# Altium project BaseBoard.PrjPcb
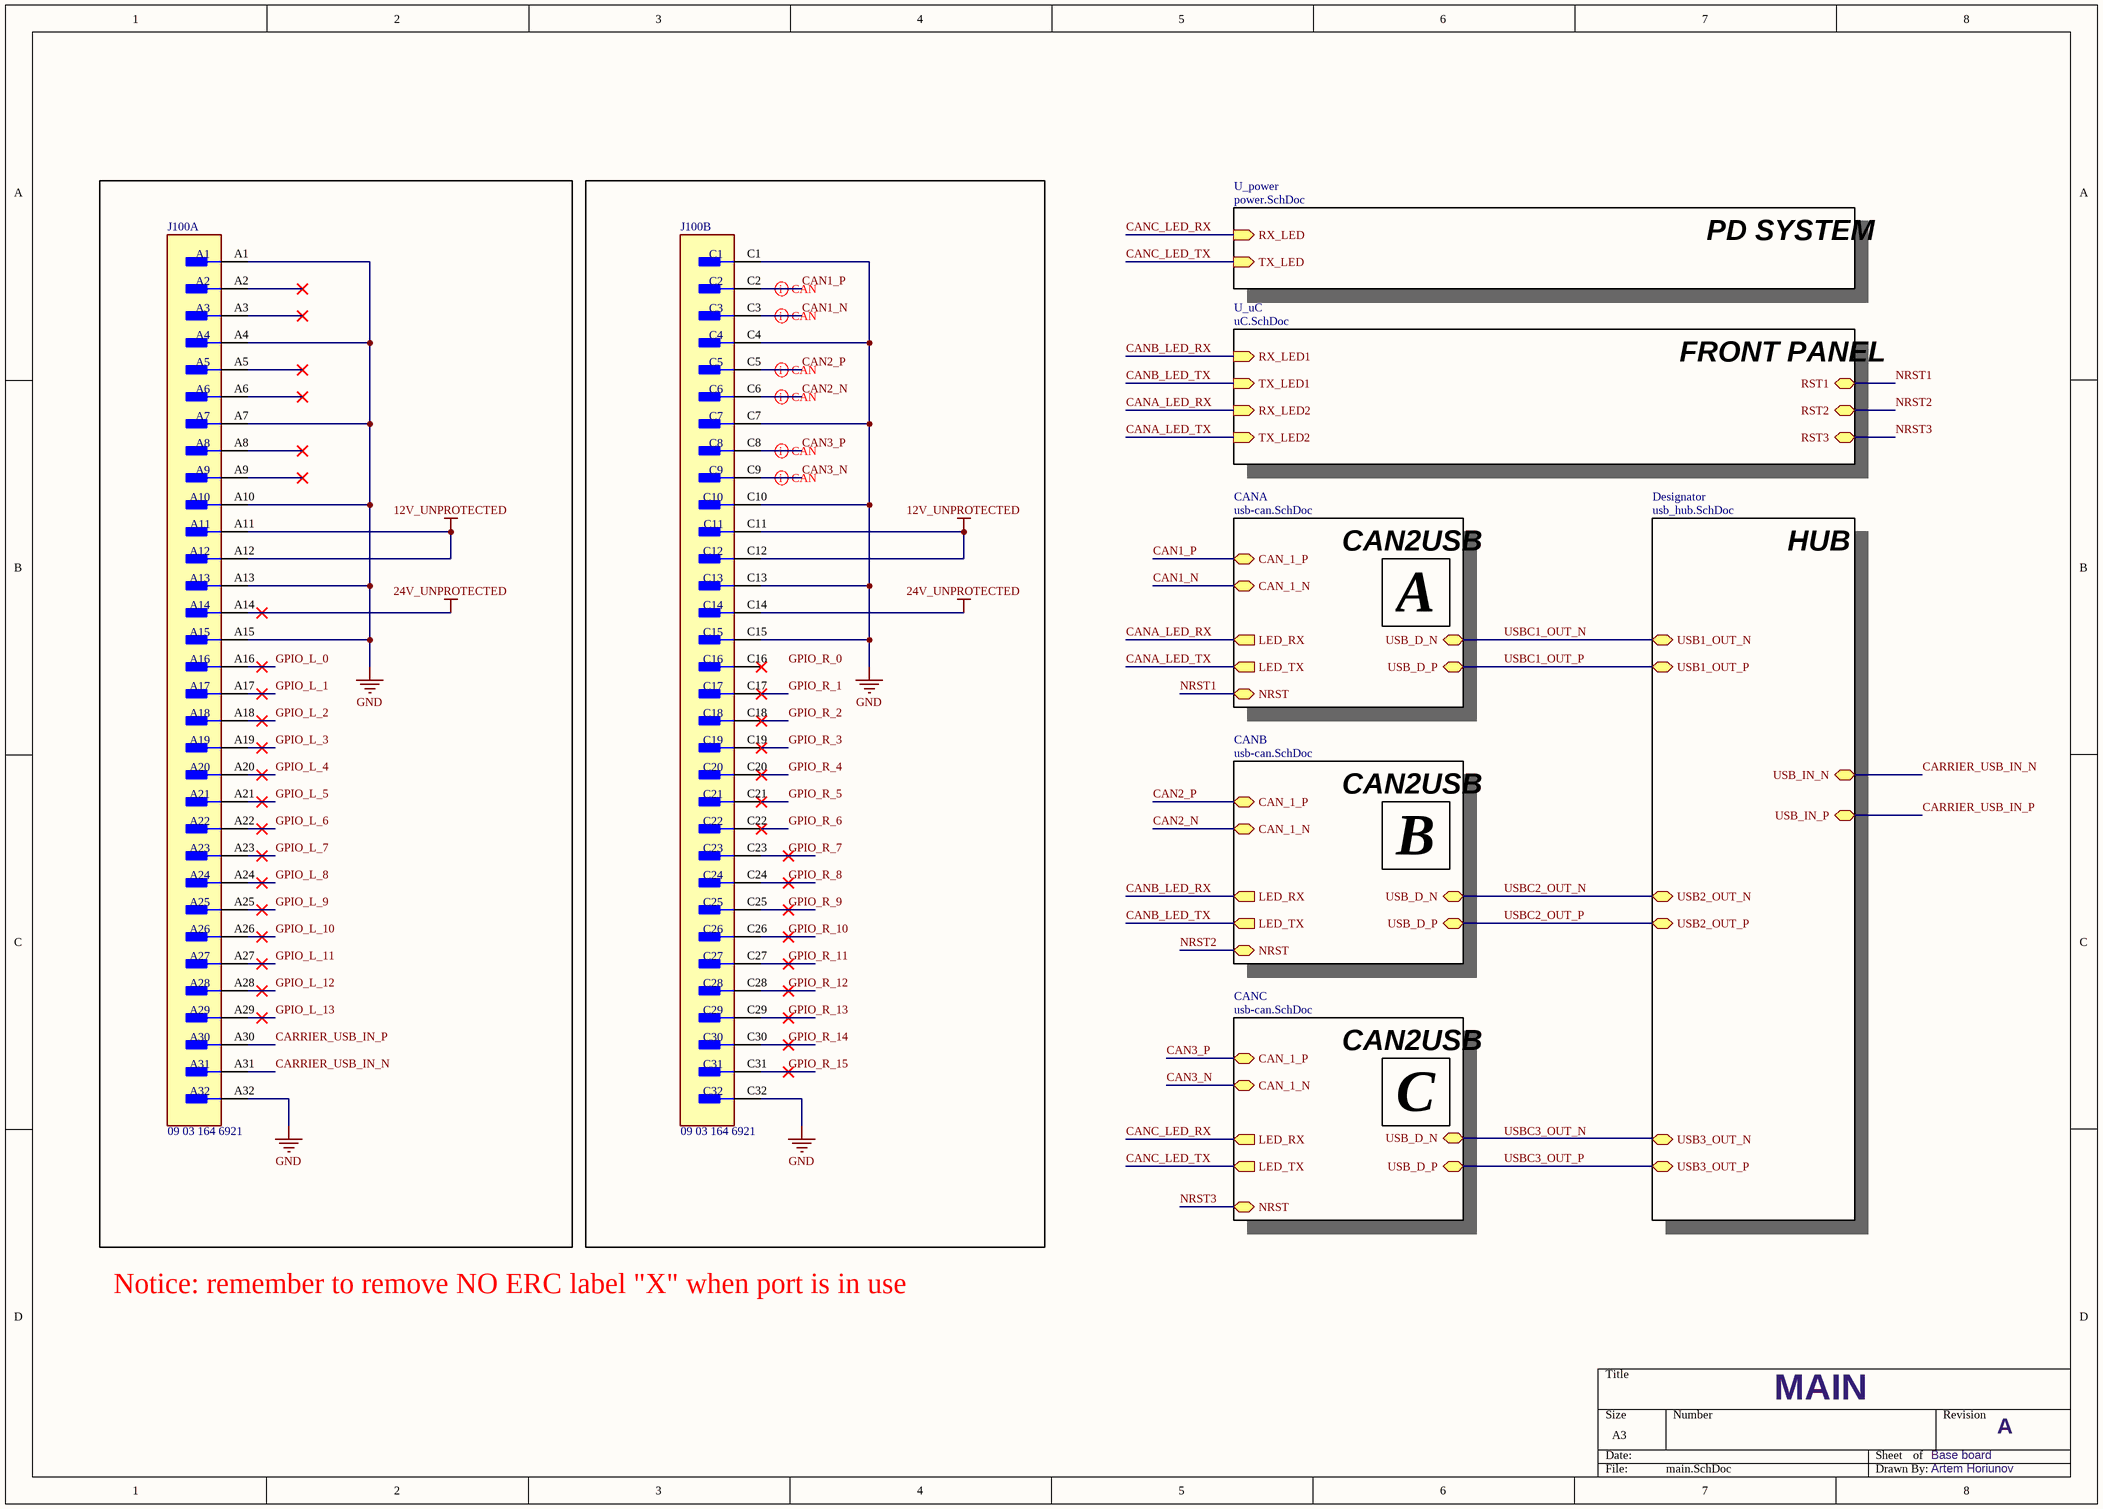
[diagram p0: main.SchDoc]
5 sheets, 186 parts. Net scope: hierarchical (ports join the sheet entries above them; power ports are global).
Board file: BaseBoard.PcbDoc
Sheets:
  main.SchDoc
    U_power = power.SchDoc
    U_uC = uC.SchDoc
    CANA = usb-can.SchDoc
    CANB = usb-can.SchDoc
    CANC = usb-can.SchDoc
    Designator = usb_hub.SchDoc

## Sheet main.SchDoc
size A3; SheetNumber: 1; SheetTotal: 5

### Parts
J100  09 03 164 6921  [FP-09_03_164_6921-MFG]  (parts A,B of 2)

### Sub-sheets
CANA = usb-can.SchDoc: CAN_1_P (bidir), CAN_1_N (bidir), LED_RX (out), LED_TX (out), USB_D_N (bidir), USB_D_P (bidir), NRST (bidir)
CANB = usb-can.SchDoc: CAN_1_P (bidir), CAN_1_N (bidir), LED_RX (out), LED_TX (out), USB_D_N (bidir), USB_D_P (bidir), NRST (bidir)
CANC = usb-can.SchDoc: CAN_1_N (bidir), CAN_1_P (bidir), LED_RX (out), LED_TX (out), USB_D_N (bidir), USB_D_P (bidir), NRST (bidir)
Designator = usb_hub.SchDoc: USB3_OUT_N (bidir), USB3_OUT_P (bidir), USB2_OUT_N (bidir), USB2_OUT_P (bidir), USB1_OUT_N (bidir), USB1_OUT_P (bidir), USB_IN_N (bidir), USB_IN_P (bidir)
U_power = power.SchDoc: RX_LED (in), TX_LED (in)
U_uC = uC.SchDoc: RX_LED1 (in), TX_LED1 (in), RX_LED2 (in), TX_LED2 (in), RST1 (bidir), RST2 (bidir), RST3 (bidir)

### Nets
12V_UNPROTECTED: J100.A11 J100.A12 J100.C11 J100.C12
24V_UNPROTECTED: J100.A14 J100.C14
GND: J100.A1 J100.A4 J100.A7 J100.A10 J100.A13 J100.A15 J100.A32 J100.C1 J100.C4 J100.C7 J100.C10 J100.C13 J100.C15 J100.C32
CAN1_N: J100.C3 ; sheet CANA/CAN_1_N
CAN1_P: J100.C2 ; sheet CANA/CAN_1_P
CAN2_N: J100.C6 ; sheet CANB/CAN_1_N
CAN2_P: J100.C5 ; sheet CANB/CAN_1_P
CAN3_N: J100.C9 ; sheet CANC/CAN_1_N
CAN3_P: J100.C8 ; sheet CANC/CAN_1_P
CANA_LED_RX: sheet U_uC/RX_LED2, sheet CANA/LED_RX
CANA_LED_TX: sheet U_uC/TX_LED2, sheet CANA/LED_TX
CANB_LED_RX: sheet U_uC/RX_LED1, sheet CANB/LED_RX
CANB_LED_TX: sheet U_uC/TX_LED1, sheet CANB/LED_TX
CANC_LED_RX: sheet U_power/RX_LED, sheet CANC/LED_RX
CANC_LED_TX: sheet U_power/TX_LED, sheet CANC/LED_TX
CARRIER_USB_IN_N: J100.A31 ; sheet Designator/USB_IN_N
CARRIER_USB_IN_P: J100.A30 ; sheet Designator/USB_IN_P
GPIO_L_0: J100.A16
GPIO_L_1: J100.A17
GPIO_L_2: J100.A18
GPIO_L_3: J100.A19
GPIO_L_4: J100.A20
GPIO_L_5: J100.A21
GPIO_L_6: J100.A22
GPIO_L_7: J100.A23
GPIO_L_8: J100.A24
GPIO_L_9: J100.A25
GPIO_L_10: J100.A26
GPIO_L_11: J100.A27
GPIO_L_12: J100.A28
GPIO_L_13: J100.A29
GPIO_R_1: J100.C17
GPIO_R_2: J100.C18
GPIO_R_3: J100.C19
GPIO_R_4: J100.C20
GPIO_R_5: J100.C21
GPIO_R_6: J100.C22
GPIO_R_7: J100.C23
GPIO_R_8: J100.C24
GPIO_R_9: J100.C25
GPIO_R_10: J100.C26
GPIO_R_11: J100.C27
GPIO_R_12: J100.C28
GPIO_R_13: J100.C29
GPIO_R_14: J100.C30
GPIO_R_15: J100.C31
NRST1: sheet U_uC/RST1, sheet CANA/NRST  [project net NRST]
NRST2: sheet U_uC/RST2, sheet CANB/NRST  [project net NRST]
NRST3: sheet U_uC/RST3, sheet CANC/NRST  [project net NRST]
U3_OUT_N: sheet CANC/USB_D_N, sheet Designator/USB3_OUT_N
USBC1_OUT_N: sheet CANA/USB_D_N, sheet Designator/USB1_OUT_N  [project net U1_OUT_N]
USBC1_OUT_P: sheet CANA/USB_D_P, sheet Designator/USB1_OUT_P  [project net U1_OUT_P]
USBC2_OUT_N: sheet CANB/USB_D_N, sheet Designator/USB2_OUT_N  [project net U2_OUT_N]
USBC2_OUT_P: sheet CANB/USB_D_P, sheet Designator/USB2_OUT_P  [project net U2_OUT_P]
USBC3_OUT_P: sheet CANC/USB_D_P, sheet Designator/USB3_OUT_P  [project net U3_OUT_P]

Not connected (* = marked no-connect by the designer): J100 A2* A3* A5* A6* A8* A9* C16*

### Layout directives
differential pair; differential pair class CAN: CAN1_N, CAN1_P, CAN2_N, CAN2_P, CAN3_N, CAN3_P

### Notes on the sheet
- PD SYSTEM
- FRONT PANEL
- CAN2USB
- HUB
- A
- B
- C
- Notice: remember to remove NO ERC label "X" when port is in use
- MAIN
- Base board
- Artem Horiunov
- Labels drawn without touching a wire or pin: GPIO_R_0, USBC3_OUT_N

### Library data of the parts
J100 = CMP-33111-000001-1: CONN DIN HDR 96POS PCB RA; Manufacturer: Harting; Pitch: 2.54mm; Number Of Contacts: 64; Current Rating: 2A; Conn Orientation: Right Angle; Conn Gender: Male; Device Class L1: Connectors; Package: 0; Number Of Rows: 2; ComponentLink2URL: https://b2b.harting.com/files/download/PRD/PDF_DS/09031200203_100580339DRW000B.pdf; Height: 11mm; Temperature Range Low: -55°C; Digikey Description: CONN DIN HDR 96POS PCB RA; Mouser Description: Conn DIN 41612 M 64 POS 2.54mm Solder RA Thru-Hole Box; Footprint Url: https://b2b.harting.com/files/download/PRD/PDF_TS/0903164X921_100072506DRW176A.pdf; Lead Free: Yes; RoHS: TRUE; Device Class L2: Backplane Connectors; Category: Conn; Manufacturer Part Number: 09 03 164 6921; Temperature Range High: +125°C; Temperature: -55°C to +125°C; ComponentLink2Description: Datasheet; Octopart: https://octopart.com/09031646921-harting+elektronik-42933; Device Class L3: unset; Automotive: No; Contact Material: Gold,Nickel

## Sheet power.SchDoc
size A3; SheetNumber: 3; SheetTotal: 5
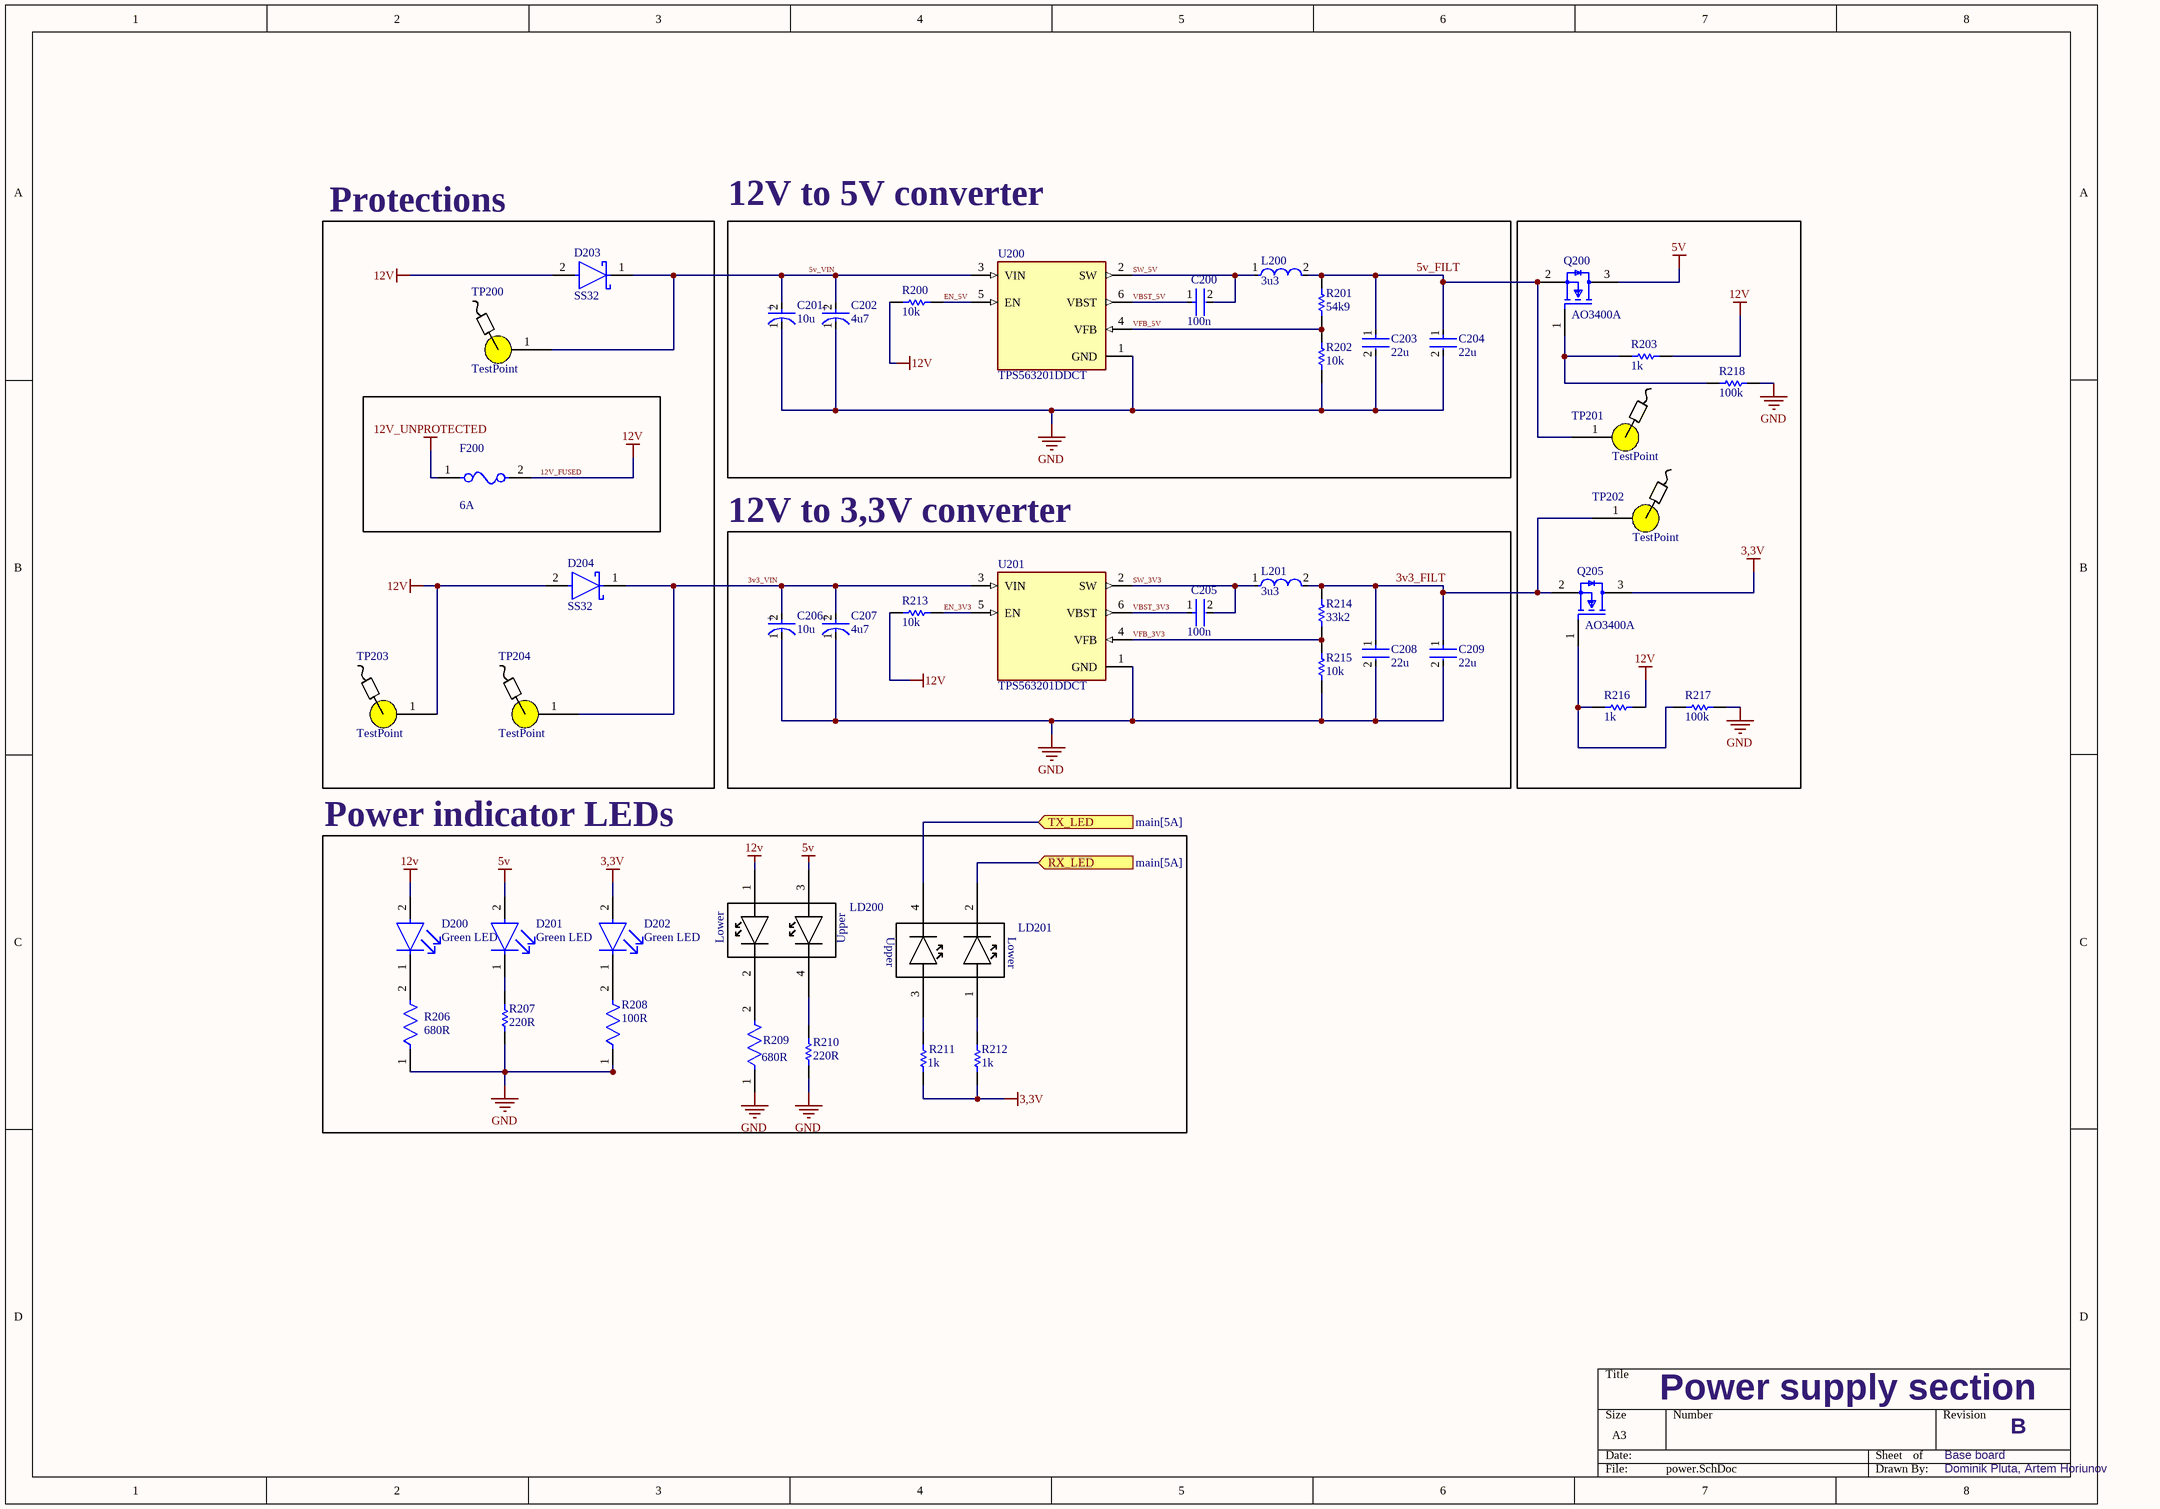
[diagram p1: power.SchDoc]

### Parts
C200  100n  [FP-C0603C-CF-MFG]
C201  10u  [FP-POSCAP-B2-MFG]
C202  4u7  [FP-POSCAP-B2-MFG]
C203  22u  [FP-C3216-085-0_2-MFG]
C204  22u  [FP-C3216-085-0_2-MFG]
C205  100n  [FP-C0603C-CF-MFG]
C206  10u  [FP-POSCAP-B2-MFG]
C207  4u7  [FP-POSCAP-B2-MFG]
C208  22u  [FP-C3216-085-0_2-MFG]
C209  22u  [FP-C3216-085-0_2-MFG]
D200  Green LED  [FP-HSME-C191-MFG]
D201  Green LED  [FP-HSME-C191-MFG]
D202  Green LED  [FP-HSME-C191-MFG]
D203  SS32  [FP-403AG-MFG]
D204  SS32  [FP-403AG-MFG]
F200  6A  [FP-0466-MFG]
L200  3u3  [FP-SRP4020TA-MFG]
L201  3u3  [FP-SRP4020TA-MFG]
LD200  (no value)  [LED_HOLDER]
LD201  (no value)  [LED_HOLDER]
Q200  AO3400A  [FP-SOT23-MFG]
Q205  AO3400A  [FP-SOT23-MFG]
R200  10k  [RESC0603(1608)_N]
R201  54k9  [RESC0603(1608)_N]
R202  10k  [RESC0603(1608)_N]
R203  1k  [RESC0603(1608)_N]
R206  680R  [FP-CRCW0603-e3-MFG]
R207  220R  [RESC1608X55X25ML10T15]
R208  100R  [FP-RC0603-0_55-MFG]
R209  680R  [FP-CRCW0603-e3-MFG]
R210  220R  [RESC1608X55X25ML10T15]
R211  1k  [RESC0603(1608)_N]
R212  1k  [RESC0603(1608)_N]
R213  10k  [RESC0603(1608)_N]
R214  33k2  [RESC0603(1608)_N]
R215  10k  [RESC0603(1608)_N]
R216  1k  [RESC0603(1608)_N]
R217  100k  [RESC0603(1608)_N]
R218  100k  [RESC0603(1608)_N]
TP200  TestPoint  [TestPoint]
TP201  TestPoint  [TestPoint]
TP202  TestPoint  [TestPoint]
TP203  TestPoint  [TestPoint]
TP204  TestPoint  [TestPoint]
U200  TPS563201DDCT  [SOT95P280X110-6N]
U201  TPS563201DDCT  [SOT95P280X110-6N]

### Blocks framed on the sheet
Protections: D203 D204 F200 TP200 TP203 TP204
12V to 5V converter: C200-C204 L200 R200-R202 U200
12V to 3,3V converter: C205-C209 L201 R213-R215 U201
Power indicator LEDs: D200-D202 LD200 LD201 R206-R212

### Ports
RX_LED (in, see main[5A]), TX_LED (in, see main[5A])

### Nets
3,3V: D202.2(A) Q205.3(D) R211.1 R212.1
5v: D201.2(A) LD200.3 Q200.3(D)
12V_FUSED: D200.2(A) D203.2(A) D204.2(A) F200.2 LD200.1 R200.2 R203.1 R213.2 R216.1 TP203.1  [also labelled 12v]
12V_UNPROTECTED: F200.1
GND: C201.1(C) C202.1(C) C203.2 C204.2 C206.1(C) C207.1(C) C208.2 C209.2 R202.1 R206.1 R207.1 R208.1 R209.1 R210.1 R215.1 R217.2 R218.2 U200.1(GND) U201.1(GND)
3v3_FILT: C208.1 C209.1 L201.2 Q205.2(S) R214.2 TP202.1
3v3_VIN: C206.2(A) C207.2(A) D204.1(C) TP204.1 U201.3(VIN)
5v_FILT: C203.1 C204.1 L200.2 Q200.2(S) R201.2 TP201.1
5v_VIN: C201.2(A) C202.2(A) D203.1(C) TP200.1 U200.3(VIN)
CANC_LED_RX: LD201.2 ; port RX_LED
CANC_LED_TX: LD201.4 ; port TX_LED
EN_3V3: R213.1 U201.5(EN)
EN_5V: R200.1 U200.5(EN)
SW_3V3: C205.2 L201.1 U201.2(SW)
SW_5V: C200.2 L200.1 U200.2(SW)
VBST_3V3: C205.1 U201.6(VBST)
VBST_5V: C200.1 U200.6(VBST)
VFB_3V3: R214.1 R215.2 U201.4(VFB)
VFB_5V: R201.1 R202.2 U200.4(VFB)
NetD200_1: D200.1(C) R206.2
NetD201_1: D201.1(C) R207.2
NetD202_1: D202.1(C) R208.2
NetLD200_2: LD200.2 R209.2
NetLD200_4: LD200.4 R210.2
NetLD201_1: LD201.1 R212.2
NetLD201_3: LD201.3 R211.2
NetQ200_1: Q200.1(G) R203.2 R218.1
NetQ205_1: Q205.1(G) R216.2 R217.1

### Notes on the sheet
- Power supply section
- Base board
- B
- Dominik Pluta, Artem Horiunov
- (in symbol CMP-05428-001070-1) +
- (in symbol DoubleStack_Side_Led_3mm) Lower; Upper

### Library data of the parts
C200 C205 = CMP-2006-03061-2: CAP CER 0.1UF 50V X7R 0603; Manufacturer: KEMET; Manufacturer Part Number: C0603C104K5RACTU; Tolerance: 0.1; Temperature Coefficient: 30ppm/°C; Material: Ceramic; Automotive Grade: Grade 1; Value: 0.10 μF; Temperature: -55°C to +125°C; RoHS: TRUE; Temperature Range High: +125°C; Lead Free: Yes; Octopart: https://octopart.com/c0603c104k5ractu-kemet-139244; Digikey Description: CAP CER 0.1UF 50V X7R 0603; Category: Cap; Package: C0603C-CF; ComponentLink2Description: Datasheet; Temperature Range Low: -55°C; Device Class L1: Passive Components; Voltage Rating: 50 V; Automotive: Yes; Device Class L3: Ceramic Capacitors; ComponentLink2URL: https://api.kemet.com/component-edge/download/datasheet/C0603C100J5GACAUTO.pdf; Capacitance: 0.10 μF; Device Class L2: Capacitors; Temperature Characteristic: X7R; Height: 0.87mm
C201 C202 C206 C207 = CMP-05428-001070-1: Molded Tantalum Polymer Capacitor 10uF 20% 16V life 2000Hours SMD 1411; Leakage Current: 48uA; ESR (Equivalent Series Resistance): 100mR; Ripple Current: 800mA; Dissipation Factor: 10%; Polarity: Polar; Voltage Rating: 16V; REACH SVHC: No SVHC; Width: 2.8mm; Construction: Flat; Features: General Purpose; Life (Hours): 2000Hour; Radiation Hardening: No; Length: 3.5mm; Termination: SMD/SMT; Series: POSCAP™ TQC; Voltage Rating (DC): 16V; Mount: Surface Mount; Min Operating Temperature: -55°C; Lead Free: Lead Free; Tolerance: 20%; Number of Pins: 2; Case/Package: 1411; Case Code (Metric): 3528; Height: 1.9mm; Height - Seated (Max): 0.083inch; Package Quantity: 2000; Capacitance: 10uF; RoHS Compliant: Yes; Case Code (Imperial): 1210; Packaging: Tape and Reel; Voltage: 16V; Max Operating Temperature: 105°C; Depth: 2.8mm
C203 C204 C208 C209 = CMP-08246-004858-1: Multilayer Ceramic Capacitors 22μF ±20% 6.3V X5R SMD 1206; Capacitance: 22uF; RoHS Compliant: Yes; Case/Package: 1206; Length: 0.126inch; Thickness: 0.037inch; Min Operating Temperature: -55°C; REACH SVHC: No SVHC; Number of Pins: 2; Weight: 0.000571oz; Resistor Type: Ceramic; Dielectric: X5R; Tolerance: 20%; Max Operating Temperature: 85°C; Package Quantity: 1; Series: C; Depth: 1.6mm; Width: 0.063inch; Lead Free: Lead Free; Dielectric Material: Ceramic; Case Code (Imperial): 1206; Mount: Surface Mount; Voltage Rating: 6.3V; Voltage Rating (DC): 6.3V; Case Code (Metric): 3216; Height: 0.85mm; Packaging: Cut Tape; Termination: SMD/SMT
D200-D202 = CMP-18399-000013-1: LED GREEN DIFFUSED 0603 SMD; Manufacturer: Broadcom; Manufacturer Part Number: HSME-C191; Forward Current: 20mA; Reverse Voltage: 5V; Forward Voltage: 2.1V; Viewing Angle: 170°; Wavelength: 572nm; Power Dissipation: 52mW; Max Junction Temp: +95°C; Luminous Intensity: 50mcd; Led Orientation: Top View; Peak Emmision Wavelength: 570nm; Package: 0; Category: Diode; ComponentLink2URL: https://docs.broadcom.com/docs/AV02-0976EN; ComponentLink2Description: Datasheet; Device Class L2: LEDs; Digikey Description: LED GREEN DIFFUSED 0603 SMD; Height: 0.7mm; RoHS: TRUE; Colour: Green; Lead Free: Yes; Device Class L1: Optoelectronics; Device Class L3: unset; Temperature Range High: +85°C; Automotive: No; Temperature: -40°C to +85°C; Octopart: https://octopart.com/hsme-c191-broadcom-71131261; Mouser Description: Standard LEDs - SMD AlInGaP Green; Temperature Range Low: -40°C
D203 D204 = CMP-00278-84331622-1: SS32 Rectifier Diode, Schottky, 1 Phase, 1 Element, 3A, 20V V(RRM), Silicon, DO-214AB; Manufacturer Lifecycle Status: ACTIVE; Forward Voltage: 500mV; Max Forward Surge Current (Ifsm): 100A; Max Reverse Leakage Current: 500µA; Max Junction Temperature (Tj): 150°C; Element Configuration: Single; Max Power Dissipation: 2.27W; Polarity: Standard; Number of Elements: 1; RoHS: Compliant; Forward Current: 3A; Height: 2.65mm; Max Reverse Voltage (DC): 20V; NexarPartId: 84331622; Max Repetitive Reverse Voltage (Vrrm): 20V; Schedule B: 8541100080, 8541100080; Lead Free: Lead Free; Current Rating: 3A; Radiation Hardening: No; Mount: Surface Mount; Max Operating Temperature: 150°C; Average Rectified Current: 3A; Number of Pins: 2; Output Current: 3A; Packaging: Cut Tape; Min Operating Temperature: -55°C; Max Surge Current: 100A; REACH SVHC: No SVHC; Case/Package: SMC; Weight: 300mg; Lifecycle Status: Production; Peak Reverse Current: 500µA; Number of Terminals: 2; Width: 6.25mm; Length: 7.15mm; Voltage Rating (DC): 20V; Peak Non-Repetitive Surge Current: 100A
F200 = CMP-08605-000093-1: Voltage Rating: 63V; Body Material: Thermoplastic; Fuse Type: Board Mount (Cartridge Style Excluded); Resistance: 220mR; Current Rating: 750mA; DC Cold Resistance: 111mR; Approvals: UL; Package Quantity: 5000; Radiation Hardening: No; Width: 0.06inch; Mount: Surface Mount; Case Code (Metric): 3216; Length: 3.18mm; Depth: 1.52mm; Series: 466; Voltage Rating (AC): 63V; Case Code (Imperial): 1206; Voltage Rating (DC): 63V; Min Operating Temperature: -55°C; Height: 0.023inch; Working Voltage: 63V; RoHS Compliant: Yes; Packaging: Tape and Reel; Number of Pins: 2; Lead Free: Lead Free; Case/Package: 1206; Max Operating Temperature: 90°C; Termination: SMD/SMT; Fuse Current: 750mA
L200 L201 = CMP-07248-000008-1: MDA4020-3R3M / 3.3uH ±20% 3.1A 65mΩ SMD,4.1x4.5mm Inductors (SMD) ROHS; Manufacturer: Bourns; Manufacturer Part Number: SRP4020TA-3R3M; Shielding: true; Test Frequency: 100kHz; Self Resonant Frequency: 40MHz; Saturation Current: 4A; Q Factor: 10; Series Resistance: 76mΩ; Automotive Grade: Grade 0; Core Material: Carbonyl Powder; Rms Current: 3.5A; Temperature Range High: +150°C; Height: 2.1mm; Temperature: -40°C to +150°C; RoHS: TRUE; Device Class L3: Fixed Inductors; Automotive: Yes; Octopart: https://octopart.com/srp4020ta-3r3m-bourns-47300338; Composition: Wirewound; Mouser Description: Ind Power Shielded Wirewound 3.3uH 20% 100KHz Carbonyl Powder 3.5A T/R; Category: Ind; ComponentLink2Description: Datasheet; ComponentLink2URL: https://www.bourns.com/docs/Product-Datasheets/SRP4020TA.pdf; Digikey Description: FIXED IND 3.3UH 3.5A 76 MOHM SMD; Lead Free: Yes; Temperature Range Low: -40°C; Inductance: 3.3uH; Tolerance: 20%; Package: SRP4020TA; Value: 3.3uH; Device Class L1: Passive Components; Device Class L2: Inductors
LD200 LD201 = DoubleStack_Side_Led_3mm
Q200 Q205 = CMP-83955-000006-1: MOSFET N-CH 30V 5.7A SOT23; Input Capacitance: 630pF; Number of Elements: 1; Rds On Max: 26.5mR; Max Power Dissipation: 1.4W; Gate to Source Voltage (Vgs): 12V; Min Operating Temperature: -55°C; Lead Free: Lead Free; Number of Pins: 3; Drain to Source Voltage (Vdss): 30V; Case/Package: SOT-23; Mount: Surface Mount; Continuous Drain Current (ID): 5.7A; Radiation Hardening: No; Packaging: Tape and Reel; Max Operating Temperature: 150°C; Power Dissipation: 1.4W
R200 R202 R203 R213 R215-R218 = CMP-1012-00081-1: 2K 0.1W 5% 0603 (1608 Metric)  SMD; Case-Metric: 1608; Value: 2000.00 Ohm; Case-EIA: 0603; Tolerance: 5 %; Technology: SMT; Power: 0.1 W
R201 R211 R212 R214 = CMP-1012-00081-1: 0.1W 1% 0603 (1608 Metric)  SMD; Tolerance: 5 %; Case-Metric: 1608; Value: 2000.00 Ohm; Case-EIA: 0603; Technology: SMT; Power: 0.1 W
R206 R209 = CMP-2000-03529-2: RES Thick Film, 680Ω, 1%, 0.1W, 100ppm/°C, 0603; Voltage Rating (DC): 75V; Max Power Dissipation: 100mW; Radiation Hardening: No; Case Code (Imperial): 0603; Number of Pins: 2; Termination: SMD/SMT; Lead Free: Lead Free; Contact Plating: Tin; Case Code (Metric): 1608; Max Operating Temperature: 155°C; Tolerance: 1%; Military Standard: Not; Features: Automotive AEC-Q200; Power Rating: 100mW; Width: 0.85mm; Depth: 0.85mm; Resistance: 680R; Height: 0.45mm; Case/Package: 0603; Min Operating Temperature: -55°C; Length: 1.55mm; Voltage Rating: 75V; Composition: Thick Film; Working Voltage: 75V; Temperature Coefficient: 100ppm/°C; Packaging: Tape and Reel; Package Quantity: 10; Weight: 7.1E-05oz; Number of Terminations: 2
R207 R210 = CMP-1659-00018-2: General Purpose Chip Resistors, 220 Ohm, +/- 1%, -55 to 155 degC, 0603 (1608 Metric), RoHS, Tape and Reel; RoHSCompliant: false; DatasheetVersion: Rev. 4, 04/2009; ComponentLink2Description: Datasheet; ComponentLink2URL: https://datasheet.ciiva.com/11808/0900766b80f96399-11808136.pdf; ComponentLink1URL: http://www.yageo.com/; ComponentLink1Description: Manufacturer URL; PackageReference: 0603; PackageDescription: 2-Pin Surface Mount Device, Body 1.6 x 0.8 mm
R208 = CMP-2100-03663-2: NexarPartId: 55402879; Voltage Rating: 50V; Power Rating: 100mW; Tolerance: 1%; Temperature Coefficient: 100ppm/°C; Resistance: 100Ω; Case/Package: 0603; Military Standard: Not; REACH SVHC: Unknown; Case Code (Metric): 0603; Max Operating Temperature: 155°C; Schedule B: 8533210045, 8533210045; Height: 450µm; Length: 1.6mm; Lead Free: Lead Free; Packaging: Tape & Reel; Case Code (Imperial): 0603; Composition: Thick Film; Min Operating Temperature: -55°C; Voltage Rating (DC): 50V; RoHS: Compliant; Depth: 800µm; Number of Pins: 2; Termination: SMD/SMT; Width: 800µm
U200 U201 = CMP-007-000000-1: Design Item ID: TPS563201DDCT; Component Type: Standard; Price: None; MP: TPS563201DDCT; Package: None; Source: TPS563201DDCT.SchLib; Value: *; Pin Count: 6; Availability: Unavailable

## Sheet uC.SchDoc
size A3; SheetNumber: 2; SheetTotal: 5
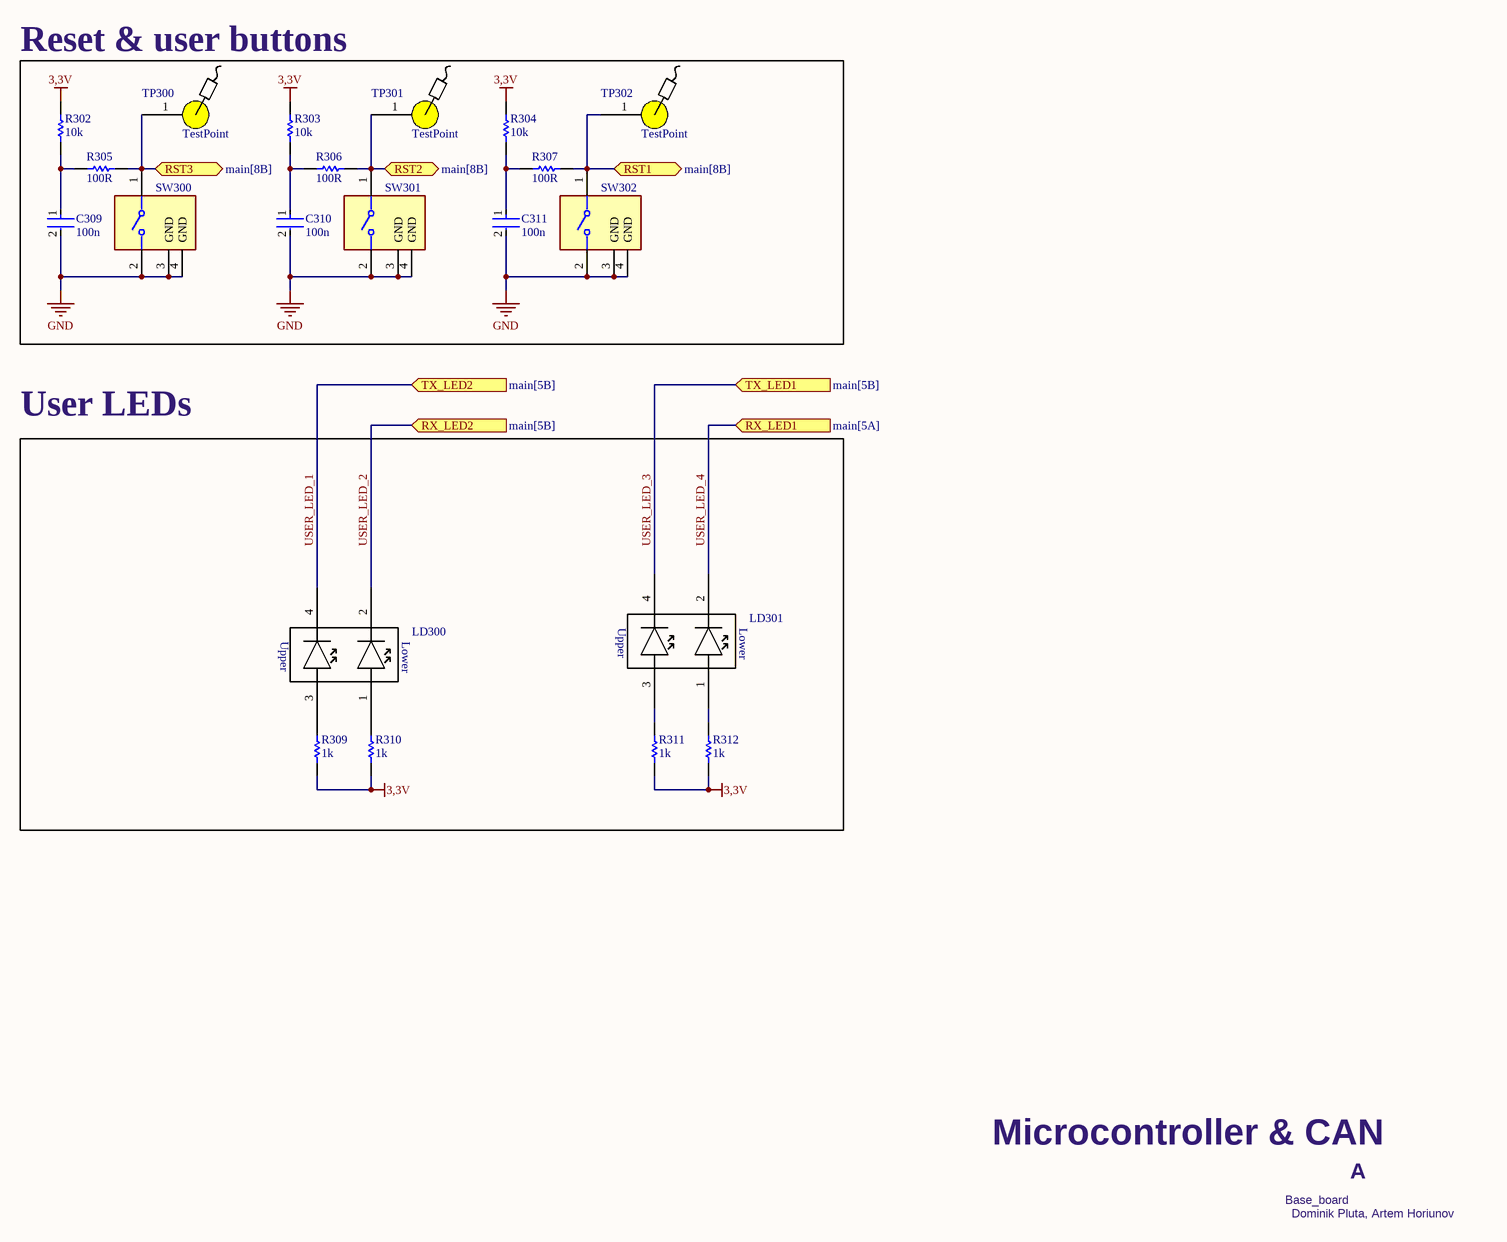
[diagram p2: uC.SchDoc]

### Parts
C309  100n  [FP-C0603C-CF-MFG]
C310  100n  [FP-C0603C-CF-MFG]
C311  100n  [FP-C0603C-CF-MFG]
LD300  (no value)  [LED_HOLDER]
LD301  (no value)  [LED_HOLDER]
R302  10k  [RESC0603(1608)_N]
R303  10k  [RESC0603(1608)_N]
R304  10k  [RESC0603(1608)_N]
R305  100R  [RESC0603(1608)_N]
R306  100R  [RESC0603(1608)_N]
R307  100R  [RESC0603(1608)_N]
R309  1k  [RESC0603(1608)_N]
R310  1k  [RESC0603(1608)_N]
R311  1k  [RESC0603(1608)_N]
R312  1k  [RESC0603(1608)_N]
SW300  B3F-3122  [FP-B3F-3122-MFG]  (value not drawn)
SW301  B3F-3122  [FP-B3F-3122-MFG]  (value not drawn)
SW302  B3F-3122  [FP-B3F-3122-MFG]  (value not drawn)
TP300  TestPoint  [TestPoint]
TP301  TestPoint  [TestPoint]
TP302  TestPoint  [TestPoint]

### Blocks framed on the sheet
Reset & user buttons: C309-C311 R302-R307 SW300-SW302 TP300-TP302
User LEDs: LD300 LD301 R309-R312

### Ports
RST1 (bidir, see main[8B]), RST2 (bidir, see main[8B]), RST3 (bidir, see main[8B]), RX_LED1 (in, see main[5A]), RX_LED2 (in, see main[5B]), TX_LED1 (in, see main[5B]), TX_LED2 (in, see main[5B])

### Nets
3,3V: R302.2 R303.2 R304.2 R309.1 R310.1 R311.1 R312.1
GND: C309.2 C310.2 C311.2 SW300.2 SW300.3(GND) SW300.4(GND) SW301.2 SW301.3(GND) SW301.4(GND) SW302.2 SW302.3(GND) SW302.4(GND)
NRST: R305.1 SW300.1 TP300.1 ; port RST3
NRST: R306.1 SW301.1 TP301.1 ; port RST2  [a separate net that carries the same name]
NRST: R307.1 SW302.1 TP302.1 ; port RST1  [a separate net that carries the same name]
USER_LED_1: LD300.4 ; port TX_LED2  [project net CANA_LED_TX]
USER_LED_2: LD300.2 ; port RX_LED2  [project net CANA_LED_RX]
USER_LED_3: LD301.4 ; port TX_LED1  [project net CANB_LED_TX]
USER_LED_4: LD301.2 ; port RX_LED1  [project net CANB_LED_RX]
NetC309_1: C309.1 R302.1 R305.2
NetC310_1: C310.1 R303.1 R306.2
NetC311_1: C311.1 R304.1 R307.2
NetLD300_1: LD300.1 R310.2
NetLD300_3: LD300.3 R309.2
NetLD301_1: LD301.1 R312.2
NetLD301_3: LD301.3 R311.2

### Notes on the sheet
- Microcontroller & CAN
- Base_board
- A
- Dominik Pluta, Artem Horiunov
- (in symbol DoubleStack_Side_Led_3mm) Upper; Lower

### Library data of the parts
C309-C311 = CMP-2006-03061-2: as C200 on sheet power; Temperature: -55°C to +125°C; RoHS: TRUE; Temperature Range High: +125°C; Lead Free: Yes; Octopart: https://octopart.com/c0603c104k5ractu-kemet-139244; Digikey Description: CAP CER 0.1UF 50V X7R 0603; Category: Cap; Package: C0603C-CF; ComponentLink2Description: Datasheet; Temperature Range Low: -55°C; Device Class L1: Passive Components; Voltage Rating: 50 V; Automotive: Yes; Device Class L3: Ceramic Capacitors; ComponentLink2URL: https://api.kemet.com/component-edge/download/datasheet/C0603C100J5GACAUTO.pdf; Capacitance: 0.10 μF; Device Class L2: Capacitors; Temperature Characteristic: X7R; Height: 0.87mm
LD300 LD301 = DoubleStack_Side_Led_3mm
R302-R307 = CMP-1012-00081-1: 0.1W 5% 0603 (1608 Metric)  SMD; Case-Metric: 1608; Value: 2000.00 Ohm; Case-EIA: 0603; Tolerance: 5 %; Technology: SMT; Power: 0.1 W
R309-R312 = CMP-1012-00081-1: as R201 on sheet power; Technology: SMT; Power: 0.1 W
SW300-SW302 = CMP-08834-000053-1: SWITCH TACTILE SPST-NO 0.05A 24V; Max Current Rating: 50mA; Actuator Type: Standard; Ratings: IP00; Number of Poles: 1; Mechanical Life: 300000Cycles; Illumination Type: Non-Illuminated; Switch Function: Off-Mom; Actuator Color: Grey; Contact Resistance: 100mR; Throw Configuration: SPST; Actuator Length: 1.6mm; Switch Travel: 0.25mm; Operating Force: 1.47N; Weight: 0.25g; Voltage Rating (DC): 24V; Contact Plating: Gold; RoHS Compliant: Yes; Contact Material: Gold; Radiation Hardening: No; Packaging: Bulk; Height: 7.4mm; Min Operating Temperature: -25°C; Electrical Life: 300000Cycles; Depth: 7.85mm; Max Voltage Rating (DC): 24V; Mount: Through Hole; Width: 6.25mm; Current Rating: 50mA; Lead Free: Lead Free; Max Operating Temperature: 70°C; Series: B3F; Contact Current Rating: 50mA; Package Quantity: 1000; Termination: PC Pins; Orientation: Right Angle; Length: 7.3mm

## Sheet usb-can.SchDoc
size A4; SheetNumber: 5; SheetTotal: 5
Used 3 times, as channels CANA, CANB, CANC. Parts and nets are listed once, with the designators drawn on the sheet.
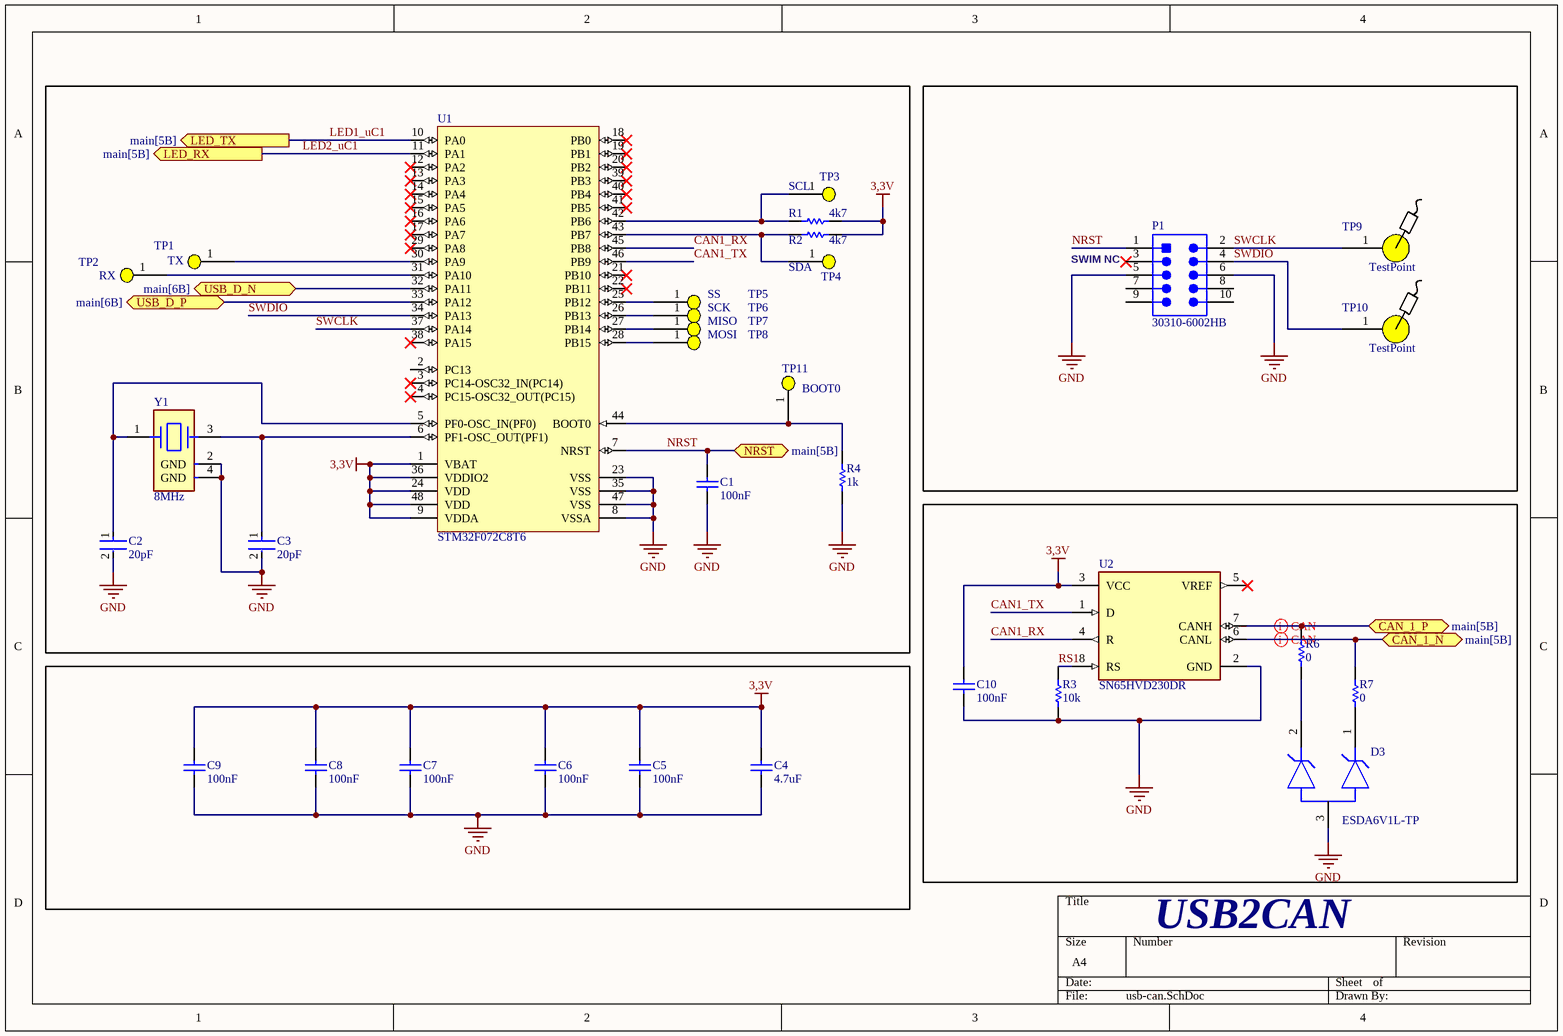
[diagram p3: usb-can.SchDoc]

### Parts
C1  100nF  [CAPC2013X88X50LL20T25]
C2  20pF  [FP-C0603C-CF-MFG]
C3  20pF  [FP-C0603C-CF-MFG]
C4  4.7uF  [CAPC2013X88X50LL20T25]
C5  100nF  [CAPC2013X88X50LL20T25]
C6  100nF  [CAPC2013X88X50LL20T25]
C7  100nF  [CAPC2013X88X50LL20T25]
C8  100nF  [CAPC2013X88X50LL20T25]
C9  100nF  [CAPC2013X88X50LL20T25]
C10  100nF  [CAPC2013X88X50LL20T25]
D3  ESDA6V1L-TP  [FP-SOT-23-MFG]
P1  30310-6002HB  [3M-30310-6002HB-10_V]
R1  4k7  [RESC0603(1608)_N]
R2  4k7  [RESC0603(1608)_N]
R3  10k  [RESC0603(1608)_N]
R4  1k  [RESC0603(1608)_N]
R6  value 0  [RESC1005X40X25ML05T10]  (hidden comment: Resistor 0R 0402 63 mW)
R7  value 0  [RESC1005X40X25ML05T10]  (hidden comment: Resistor 0R 0402 63 mW)
TP1  TX  [TestPoint]
TP2  RX  [TestPoint]
TP3  SCL  [TestPoint]
TP4  SDA  [TestPoint]
TP5  SS  [TestPoint]
TP6  SCK  [TestPoint]
TP7  MISO  [TestPoint]
TP8  MOSI  [TestPoint]
TP9  TestPoint  [TestPoint]
TP10  TestPoint  [TestPoint]
TP11  BOOT0  [TestPoint]
U1  STM32F072C8T6  [STM-LQFP48_M]
U2  SN65HVD230DR  [FP-D0008A-IPC_A]
Y1  8MHz  [FP-7M-MFG]

### Blocks framed on the sheet
SWIM NC: P1 TP9 TP10

### Ports
CAN_1_N (bidir, see main[5B]), CAN_1_P (bidir, see main[5B]), LED_RX (out, see main[5B]), LED_TX (out, see main[5B]), NRST (bidir, see main[5B]), USB_D_N (bidir, see main[6B]), USB_D_P (bidir, see main[6B])

### Nets
3,3V: C4.2 C5.2 C6.2 C7.2 C8.2 C9.2 C10.2 R1.1 R2.1 U1.1(VBAT) U1.9(VDDA) U1.24(VDD) U1.36(VDDIO2) U1.48(VDD) U2.3(VCC)
GND: C1.1 C2.2 C3.2 C4.1 C5.1 C6.1 C7.1 C8.1 C9.1 C10.1 D3.3 P1.5 P1.6 R3.1 R4.1 U1.8(VSSA) U1.23(VSS) U1.35(VSS) U1.47(VSS) U2.2(GND) Y1.2(GND) Y1.4(GND)
CAN1_RX: U1.45(PB8) U2.4(R)
CAN1_TX: U1.46(PB9) U2.1(D)
CAN_1_N: R7.2 U2.6(CANL) ; port CAN_1_N
CAN_1_P: R6.2 U2.7(CANH) ; port CAN_1_P
LED1_uC1: U1.10(PA0) ; port LED_TX
LED2_uC1: U1.11(PA1) ; port LED_RX
NRST: C1.2 P1.1 U1.7(NRST) ; port NRST
RS1: R3.2 U2.8(RS)
SWCLK: P1.2 TP9.1 U1.37(PA14)
SWDIO: P1.4 TP10.1 U1.34(PA13)
USB_D_N: U1.32(PA11) ; port USB_D_N
USB_D_P: U1.33(PA12) ; port USB_D_P
NetC2_1: C2.1 U1.5(PF0-OSC_IN(PF0)) Y1.1
NetC3_1: C3.1 U1.6(PF1-OSC_OUT(PF1)) Y1.3
NetD3_1: D3.1 R7.1
NetD3_2: D3.2 R6.1
NetR1_2: R1.2 TP3.1 U1.42(PB6)
NetR2_2: R2.2 TP4.1 U1.43(PB7)
NetR4_2: R4.2 TP11.1 U1.44(BOOT0)
NetTP1_1: TP1.1 U1.30(PA9)
NetTP2_1: TP2.1 U1.31(PA10)
NetTP5_1: TP5.1 U1.25(PB12)
NetTP6_1: TP6.1 U1.26(PB13)
NetTP7_1: TP7.1 U1.27(PB14)
NetTP8_1: TP8.1 U1.28(PB15)

Not connected (* = marked no-connect by the designer): P1 3* 7 8 9 10; U1 2(PC13) 3(PC14-OSC32_IN(PC14))* 4(PC15-OSC32_OUT(PC15))* 12(PA2)* 13(PA3)* 14(PA4)* 15(PA5)* 16(PA6)* 17(PA7)* 18(PB0)* 19(PB1)* 20(PB2)* 21(PB10)* 22(PB11)* 29(PA8)* 38(PA15)* 39(PB3)* 40(PB4)* 41(PB5)*; U2 5(VREF)*

### Channels
CANA: designators end in _CANA; ports CAN_1_N=CAN1_N CAN_1_P=CAN1_P LED_RX=CANA_LED_RX LED_TX=CANA_LED_TX NRST=NRST USB_D_N=U1_OUT_N USB_D_P=U1_OUT_P
CANB: designators end in _CANB; ports CAN_1_N=CAN2_N CAN_1_P=CAN2_P LED_RX=CANB_LED_RX LED_TX=CANB_LED_TX NRST=NRST USB_D_N=U2_OUT_N USB_D_P=U2_OUT_P
CANC: designators end in _CANC; ports CAN_1_N=CAN3_N CAN_1_P=CAN3_P LED_RX=CANC_LED_RX LED_TX=CANC_LED_TX NRST=NRST USB_D_N=U3_OUT_N USB_D_P=U3_OUT_P

### Layout directives
differential pair; differential pair class CAN: CAN1_N, CAN1_P

### Notes on the sheet
- USB2CAN

### Library data of the parts
C1 C4-C10 = CMP-2007-00266-1: Manufacturer: Kemet; Part Number: C0805C103K5RACTU
C2 C3 = CMP-2006-03061-2: as C200 on sheet power; Temperature: -55°C to +125°C; RoHS: TRUE; Temperature Range High: +125°C; Lead Free: Yes; Octopart: https://octopart.com/c0603c104k5ractu-kemet-139244; Digikey Description: CAP CER 0.1UF 50V X7R 0603; Category: Cap; Package: C0603C-CF; ComponentLink2Description: Datasheet; Temperature Range Low: -55°C; Device Class L1: Passive Components; Voltage Rating: 50 V; Automotive: Yes; Device Class L3: Ceramic Capacitors; ComponentLink2URL: https://api.kemet.com/component-edge/download/datasheet/C0603C100J5GACAUTO.pdf; Capacitance: 0.10 μF; Device Class L2: Capacitors; Temperature Characteristic: X7R; Height: 0.87mm
D3 = CMP-56244-000002-1: TVS DIODE 5.25V SOT23; Power Dissipation: 300W; Direction: Unidirectional; Breakdown Voltage: 6.65V; Capacitance: 140pF; Element Configuration: Common Anode; Number of Channels: 2; Min Breakdown Voltage: 6.1V; Max Breakdown Voltage: 7.2V; Power Line Protection: No; Leakage Current: 20uA; Peak Pulse Power: 300W; Lead Free: Lead Free; Composition: Zener; Package Quantity: 1; Reverse Standoff Voltage: 5.25V; Working Voltage: 5.25V; Packaging: Tape and Reel; Case/Package: SOT-23; Mount: Surface Mount; Radiation Hardening: No; Number of Unidirectional Channels: 2; Number of Pins: 3; Max Operating Temperature: 150°C; Min Operating Temperature: -55°C; Depth: 1.4mm; Length: 3.04mm; Termination: SMD/SMT
P1 = CMP-2000-05031-1: Male Header, Pitch 2.54 mm, 2 x 5 Position, Height 9.3 mm, Tail Length 2.79 mm, -55 to 105 degC, RoHS, Bulk; Manufacturer: 3M; Current Rating: 1A; Brand: 3MElectronicSolutionsDivision; Mounting Angle: Straight; Number of Positions: 10Position; Mating Post Length: 5.99mm; Pitch: 2.54mm; Manufacturer URL: http://www.3m.com/; Factory Pack Quantity: 1000; Mounting Style: StraightPin; Number of Rows: 2Row; Termination Post Length: 2.79mm; Contact Gender: Pin(Male); Contact Material: Brass; Termination Style: ThroughHole; Product: Headers; Packaging: Tray; Product Category: Headers&WireHousings; Type: Shrouded; Datasheet URL: http://datasheet.octopart.com/30310-6002HB-3M-datasheet-11537585.pdf; Datasheet Version: Apr-12; Contact Plating: Gold; Row Spacing: 2.54mm; Housing Material: Polyester; Series: 303; RoHS: Details
R1-R4 = CMP-1012-00081-1: as R200 on sheet power; Tolerance: 5 %; Technology: SMT; Power: 0.1 W
R6 R7 = CMP-009-00004-5: Chip Resistor, 0 Ohm, 0.063 W, -55 to 155 degC, 0402 (1005 Metric); Power: 63mW; Voltage Rating: 50V; Max Operating Temperature: 155°C; Pins: 2; RoHS Compliant: True; Min Operating Temperature: -55°C; Mounting Technology: SM; Case/Package: 0402
TP1-TP8 TP11 = TestPoint
U1 = CMP-0304-00166-4: ARM Cortex-M0 32-bit MCU, 64 KB Flash, 16 KB Internal RAM, 37 I/Os, 48-Pin LQFP, -40 to 85 degC, Tray; Manufacturer: STMicroelectronics; Operating Frequency(F) (Processor speed) (MHz): 48; FLASH Size (Prog) (kB): 64; I/Os (High Current): 37; D/A Converter: 1; Internal RAM Size (kB): 16; Supply Voltage(Vcc) min (V): 2; Package Reference: LQFP48; DatasheetVersion: Rev. 5; Core: ARM Cortex-M0; ComponentLink1Description: Manufacturer URL; ComponentLink1URL: http://www.st.com/; Packing: Tray; Mounting Technology: Surface Mount; Package Description: 48-Pin Low Profile Quad Flat Package, Body 7 x 7 mm, Pitch 0.5 mm; ComponentLink2URL: http://www.st.com/st-web-ui/static/active/en/resource/technical/document/datasheet/DM00090510.pdf; ComponentLink2Description: Datasheet; PartNumber: STM32F072C8T6
U2 = CMP-0315-00015-3: IC TRANSCEIVER HALF 1/1 8SOIC; Number of Transceivers: 1; Operating Supply Voltage: 3.3V; Number of I/Os: 2; Max Supply Current: 17mA; Max Supply Voltage: 3.6V; Min Supply Voltage: 3V; Data Rate: 1Mbps; Min Operating Temperature: -40°C; Packaging: Tape and Reel; Lead Free: Lead Free; Number of Transmit Buffers: 1; Max Operating Temperature: 85°C; Number of Receive Buffers: 1; Number of Pins: 8; Package Quantity: 1; Radiation Hardening: No; Case/Package: D; REACH SVHC: No SVHC; Weight: 0.002561oz; Termination: SMD/SMT; Contact Plating: Gold; Nominal Supply Current: 17mA; Number of Receivers: 1; Number of Drivers: 1
Y1 = CMP-18717-000311-1: Crystal; ESR (Equivalent Series Resistance): 100R; Frequency: 12MHz; Frequency Stability: 10ppm; Load Capacitance: 10pF; Width: 0.098inch; Number of Pins: 4; Case/Package: SMD/SMT; REACH SVHC: No SVHC; Mount: Surface Mount; Max Operating Temperature: 70°C; RoHS Compliant: Yes; Depth: 2.5mm; Length: 3.2mm; Termination: SMD/SMT; Frequency Tolerance: 10ppm; Min Operating Temperature: -20°C; Series: 7M; Packaging: Tape and Reel; Tolerance: 10ppm; Height: 0.031inch; Package Quantity: 3000

## Sheet usb_hub.SchDoc
size A4; SheetNumber: 4; SheetTotal: 5
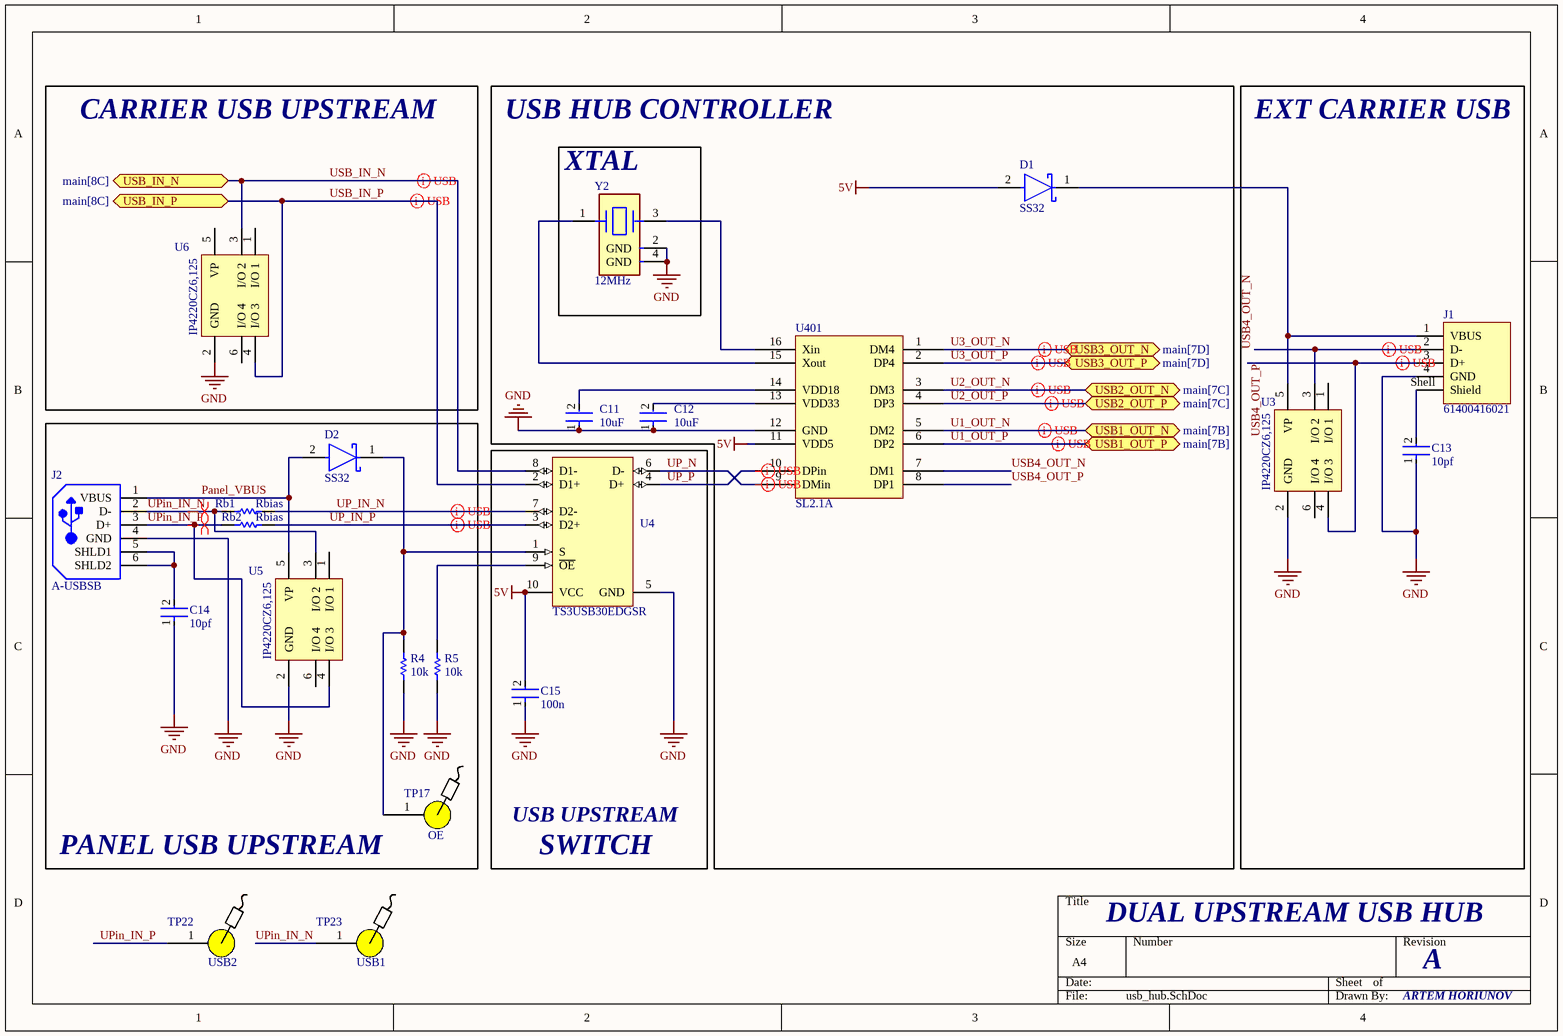
[diagram p4: usb_hub.SchDoc]

### Parts
C11  10uF  [FP-C0603C-CF-MFG]
C12  10uF  [FP-C0603C-CF-MFG]
C13  10pf  [FP-C0603C-CF-MFG]
C14  10pf  [FP-C0603C-CF-MFG]
C15  100n  [FP-C0603C-CF-MFG]
D1  SS32  [FP-403AG-MFG]
D2  SS32  [FP-403AG-MFG]
J1  61400416021  [61400416021]
J2  A-USBSB  [ASSM-A-USBSB-4_V]
R4  10k  [RESC0603(1608)_N]
R5  10k  [RESC0603(1608)_N]
Rb1  Rbias  [RESC1005X40X25NL05T05]
Rb2  Rbias  [RESC1005X40X25NL05T05]
TP17  OE  [TestPoint]
TP22  USB2  [TestPoint]
TP23  USB1  [TestPoint]
U3  IP4220CZ6,125  [NXP-SOT457_L]
U4  TS3USB30EDGSR  [DGS0010A_N]
U5  IP4220CZ6,125  [NXP-SOT457_L]
U6  IP4220CZ6,125  [NXP-SOT457_L]
U401  SL2.1A  [SOIC127P600X160-16N]
Y2  12MHz  [FP-7M-MFG]

### Blocks framed on the sheet
CARRIER USB UPSTREAM: U6
USB HUB CONTROLLER: C11 C12 D1 U401
EXT CARRIER USB: C13 J1 U3
XTAL: Y2
PANEL USB UPSTREAM: C14 D2 J2 R4 R5 Rb1 Rb2 TP17 U5
SWITCH: C15 U4

### Ports
USB1_OUT_N (bidir, see main[7B]), USB1_OUT_P (bidir, see main[7B]), USB2_OUT_N (bidir, see main[7C]), USB2_OUT_P (bidir, see main[7C]), USB3_OUT_N (bidir, see main[7D]), USB3_OUT_P (bidir, see main[7D]), USB_IN_N (bidir, see main[8C]), USB_IN_P (bidir, see main[8C])

### Nets
5v: C15.2 D1.2(A) U4.10(VCC) U401.11(VDD5)
GND: C11.1 C12.1 C13.1 C14.1 C15.1 J1.4(GND) J2.4(GND) R4.1 R5.1 U3.2(GND) U4.5(GND) U5.2(GND) U6.2(GND) U401.12(GND) Y2.2(GND) Y2.4(GND)
Panel_VBUS: D2.2(A) J2.1(VBUS) U5.5(VP)
U1_OUT_N: U401.5(DM2) ; port USB1_OUT_N
U1_OUT_P: U401.6(DP2) ; port USB1_OUT_P
U2_OUT_N: U401.3(DM3) ; port USB2_OUT_N
U2_OUT_P: U401.4(DP3) ; port USB2_OUT_P
U3_OUT_N: U401.1(DM4) ; port USB3_OUT_N
U3_OUT_P: U401.2(DP4) ; port USB3_OUT_P
UP_IN_N: Rb1.2 U4.7(D2-)
UP_IN_P: Rb2.2 U4.3(D2+)
UP_N: U4.6(D-) U401.9(DMin)
UP_P: U4.4(D+) U401.10(DPin)
UPin_IN_N: J2.2(D-) Rb1.1 TP23.1 U5.3(I/O_2)
UPin_IN_P: J2.3(D+) Rb2.1 TP22.1 U5.4(I/O_3)
USB4_OUT_N: J1.2(D-) U3.3(I/O_2) U401.7(DM1)
USB4_OUT_P: J1.3(D+) U3.4(I/O_3) U401.8(DP1)
USB_IN_N: U4.8(D1-) U6.3(I/O_2) ; port USB_IN_N  [project net CARRIER_USB_IN_N]
USB_IN_P: U4.2(D1+) U6.4(I/O_3) ; port USB_IN_P  [project net CARRIER_USB_IN_P]
NetC11_2: C11.2 U401.14(VDD18)
NetC12_2: C12.2 U401.13(VDD33)
NetC13_2: C13.2 J1.Shell(Shield)
NetC14_2: C14.2 J2.5(SHLD1) J2.6(SHLD2)
NetD1_1: D1.1(C) J1.1(VBUS) U3.5(VP)
NetD2_1: D2.1(C) R4.2 TP17.1 U4.1(S)
NetR5_2: R5.2 U4.9(~{OE})
NetU401_15: U401.15(Xout) Y2.1
NetU401_16: U401.16(Xin) Y2.3

Not connected (* = marked no-connect by the designer): U3 1(I/O_1) 6(I/O_4); U5 1(I/O_1) 6(I/O_4); U6 1(I/O_1) 5(VP) 6(I/O_4)

### Layout directives
differential pair; differential pair class USB: CARRIER_USB_IN_N, CARRIER_USB_IN_P, U1_OUT_N, U1_OUT_P, U2_OUT_N, U2_OUT_P, U3_OUT_N, U3_OUT_P, UP_IN_N, UP_IN_P, UP_N, UP_P, USB4_OUT_N, USB4_OUT_P
differential pair: UPin_IN_N, UPin_IN_P

### Notes on the sheet
- USB UPSTREAM
- DUAL UPSTREAM USB HUB
- A
- ARTEM HORIUNOV

### Library data of the parts
C11-C15 = CMP-2006-03061-2: as C200 on sheet power; Temperature: -55°C to +125°C; RoHS: TRUE; Temperature Range High: +125°C; Lead Free: Yes; Octopart: https://octopart.com/c0603c104k5ractu-kemet-139244; Digikey Description: CAP CER 0.1UF 50V X7R 0603; Category: Cap; Package: C0603C-CF; ComponentLink2Description: Datasheet; Temperature Range Low: -55°C; Device Class L1: Passive Components; Voltage Rating: 50 V; Automotive: Yes; Device Class L3: Ceramic Capacitors; ComponentLink2URL: https://api.kemet.com/component-edge/download/datasheet/C0603C100J5GACAUTO.pdf; Capacitance: 0.10 μF; Device Class L2: Capacitors; Temperature Characteristic: X7R; Height: 0.87mm
D1 D2 = CMP-00278-84331622-1: as D203 on sheet power; RoHS: Compliant; Forward Current: 3A; Height: 2.65mm; Max Reverse Voltage (DC): 20V; NexarPartId: 84331622; Max Repetitive Reverse Voltage (Vrrm): 20V; Schedule B: 8541100080, 8541100080; Lead Free: Lead Free; Current Rating: 3A; Radiation Hardening: No; Mount: Surface Mount; Max Operating Temperature: 150°C; Average Rectified Current: 3A; Number of Pins: 2; Output Current: 3A; Packaging: Cut Tape; Min Operating Temperature: -55°C; Max Surge Current: 100A; REACH SVHC: No SVHC; Case/Package: SMC; Weight: 300mg; Lifecycle Status: Production; Peak Reverse Current: 500µA; Number of Terminals: 2; Width: 6.25mm; Length: 7.15mm; Voltage Rating (DC): 20V; Peak Non-Repetitive Surge Current: 100A
J1 = CMP-1502-03227-2: NexarPartId: 21041530; Contact Resistance: 20mΩ; Gender: Receptacle; Voltage Rating (DC): 30V; Current Rating: 1.5A; Connector Type: USB; Insulation Resistance: 1GΩ; USB Standard: USB 2.0; Number of Contacts: 4; Number of Ports: 1; Width: 14.4mm; REACH SVHC: Unknown; Contact Plating: Gold; Length: 15.8mm; Lead Free: Lead Free; Max Operating Temperature: 105°C; Orientation: Horizontal; Contact Material: Copper; Voltage Rating: 30V; Min Operating Temperature: -40°C; Flammability Rating: UL94 V-0; Color: White; RoHS: Compliant; Number of Pins: 4; Mount: Horizontal, Through Hole; Number of Positions: 4; Operating Supply Voltage: 30V; Insulation Material: PBT; Termination: Solder
J2 = CMP-2000-05874-1: Connector Receptacle, USB Type B, Right Angle, -20 to 85 degC, 4-Pin THD, RoHS, Tray; Manufacturer: ASSMANN WSW; Gender: Female; CAD Drawing: 3DCADModel; Number of Ports: 1; Mounting Type: ThroughHole; Datasheet URL: https://datasheet.ciiva.com/11731/0900766b80da421f-11731321.pdf; Datasheet Version: 12/2009; Manufacturer URL: http://www.assmann.us/; Package Description: 4-Pin Through Hole Device, Body 16.5 x 12.04 mm; Body Orientation: RightAngle; Mounting Technology: ThroughHole; Package Reference: USBSB; Termination Method: Solder
R4 R5 = CMP-1012-00081-1: as R201 on sheet power; Technology: SMT; Power: 0.1 W
Rb1 Rb2 = CMP-2002-08143-1: Part Number: CRCW040210R0FKED; Manufacturer: Vishay Dale
TP17 TP22 TP23 = TestPoint
U3 U5 U6 = CMP-2000-06457-1: Dual USB 2.0 integrated ESD protection, 0 to 5.5 V, -40 to 85 degC, 6-Pin TSOP (SOT457), RoHS, Tape and Reel; Manufacturer: NXP Semiconductors; Product Height (mm): 1mm; Rad Hardened: No; Package Version: 06-03-16, 03/2006; Product Length (mm): 3.1mm; VIN Max: 5.5V; Configuration: Quad; Suppressor Type: DiodeArrays; Number of Channels: 4; VF: 0.7V; Capacitance Value: 1.2pF; Product Depth (mm): 1.7mm; VIN Min: 0V; Leakage Current (Max): 0.1uA; ESD Protection Voltage: 8KV@ContactDisc; Direction Type: Uni-Directional; Manufacturer URL: http://www.nxp.com/; Package Reference: SOT457; Datasheet URL: http://cache.nxp.com/documents/data_sheet/IP4220CZ6.pdf; Operating Temperature Max Deg. C: 85C; Packaging: TapeandReel; Package Description: 6-Pin Thin Small Outline Package, Body 2.9 x 1.5 mm, Pitch 0.95 mm; PartNumber: IP4220CZ6; Mounting Technology: SurfaceMount; Working Voltage (Max): 5.5V; Operating Temperature Min Deg. C: -40C; Working Voltage: 5.5V; Package / Case: TSOP; Package URL: http://www.nxp.com/documents/outline_drawing/sot457_po.pdf; Leakage Current: 0.1uA; Pin Count: 6; Mounting Style: SurfaceMount; Datasheet Version: Rev. 5, 07/2011
U4 = CMP-0309-00091-2: High-Speed USB 2.0 (480-Mbps) 1:2 Multiplexer / Demultiplexer Switch with Single, 10 ohm RON, 3.0 to 4.3V, -40 to 85 degC, 10-Pin MSOP (DGS), Green (RoHS & no Sb/Br); Manufacturer: Texas Instruments; Architecture: "1","2 mux/demux"; tpd max(ns): 0.25; ICC(uA): 1; IL OFF(Max)(nA): 2; OFF Time(Max)(ns): 30; SubFamily: USB Switch; ESD HBM(kV): +/-8; Bandwidth(MHz): 900; RON Mis-match(Max)(Ohms): 0.35; ON Time(Max)(ns): 25; ron(max)(ohms): 10; PartNumber: TS3USB30EDGSR; ComponentLink1URL: http://www.ti.com/general/docs/lit/getliterature.tsp?genericPartNumber=TS3USB30E&fileType=pdf; Vcc range(V): 3.0 to 4.3; PackageReference: DGS0010A; Code_JEDEC: MO-187-BA; PackageDescription: 10-Pin Thin Shrink Small Outline Package 0.5 mm Pitch; Eco-Plan: Green (RoHS & no Sb/Br); ComponentLink2URL: http://www.ti.com/litv/pdf/mpds035b; Number of Channels: 2; Mounting Technology: Surface Mount; PackageVersion: revC, Feb-2004; DatasheetVersion: SCDS255D; ComponentLink1Description: Datasheet; ComponentLink2Description: Package Specification; RON Flatness(Max)(Ohms): 2
Y2 = CMP-18717-000311-1: Crystal; ESR (Equivalent Series Resistance): 100R; Frequency Stability: 10ppm; Load Capacitance: 10pF; Width: 0.098inch; Number of Pins: 4; Case/Package: SMD/SMT; REACH SVHC: No SVHC; Frequency: 12MHz; Mount: Surface Mount; Max Operating Temperature: 70°C; RoHS Compliant: Yes; Depth: 2.5mm; Length: 3.2mm; Termination: SMD/SMT; Frequency Tolerance: 10ppm; Min Operating Temperature: -20°C; Series: 7M; Packaging: Tape and Reel; Tolerance: 10ppm; Height: 0.031inch; Package Quantity: 3000

## Nets that join several sheets
3,3V: power (D202.2 Q205.3 R211.1 R212.1), uC (7 pins), CANA (15 pins), CANB (15 pins), CANC (15 pins)
5v: power (D201.2 LD200.3 Q200.3), usb_hub (C15.2 D1.2 U4.10 U401.11)
12V_UNPROTECTED: main (J100.A11 J100.A12 J100.C11 J100.C12), power (F200.1)
GND: main (14 pins), power (19 pins), uC (12 pins), CANA (22 pins), CANB (22 pins), CANC (22 pins), usb_hub (16 pins)
CAN1_N: main (J100.C3), CANA (R7_CANA.2 U2_CANA.6)
CAN1_P: main (J100.C2), CANA (R6_CANA.2 U2_CANA.7)
CAN2_N: main (J100.C6), CANB (R7_CANB.2 U2_CANB.6)
CAN2_P: main (J100.C5), CANB (R6_CANB.2 U2_CANB.7)
CAN3_N: main (J100.C9), CANC (R7_CANC.2 U2_CANC.6)
CAN3_P: main (J100.C8), CANC (R6_CANC.2 U2_CANC.7)
CANA_LED_RX: uC (LD300.2), CANA (U1_CANA.11)
CANA_LED_TX: uC (LD300.4), CANA (U1_CANA.10)
CANB_LED_RX: uC (LD301.2), CANB (U1_CANB.11)
CANB_LED_TX: uC (LD301.4), CANB (U1_CANB.10)
CANC_LED_RX: power (LD201.2), CANC (U1_CANC.11)
CANC_LED_TX: power (LD201.4), CANC (U1_CANC.10)
CARRIER_USB_IN_N: main (J100.A31), usb_hub (U4.8 U6.3)
CARRIER_USB_IN_P: main (J100.A30), usb_hub (U4.2 U6.4)
NRST: uC (R305.1 SW300.1 TP300.1), CANC (C1_CANC.2 P1_CANC.1 U1_CANC.7)
NRST: uC (R306.1 SW301.1 TP301.1), CANB (C1_CANB.2 P1_CANB.1 U1_CANB.7)
NRST: uC (R307.1 SW302.1 TP302.1), CANA (C1_CANA.2 P1_CANA.1 U1_CANA.7)
U1_OUT_N: CANA (U1_CANA.32), usb_hub (U401.5)
U1_OUT_P: CANA (U1_CANA.33), usb_hub (U401.6)
U2_OUT_N: CANB (U1_CANB.32), usb_hub (U401.3)
U2_OUT_P: CANB (U1_CANB.33), usb_hub (U401.4)
U3_OUT_N: CANC (U1_CANC.32), usb_hub (U401.1)
U3_OUT_P: CANC (U1_CANC.33), usb_hub (U401.2)